# Altium project Dentist_camera_extender.PrjPcb
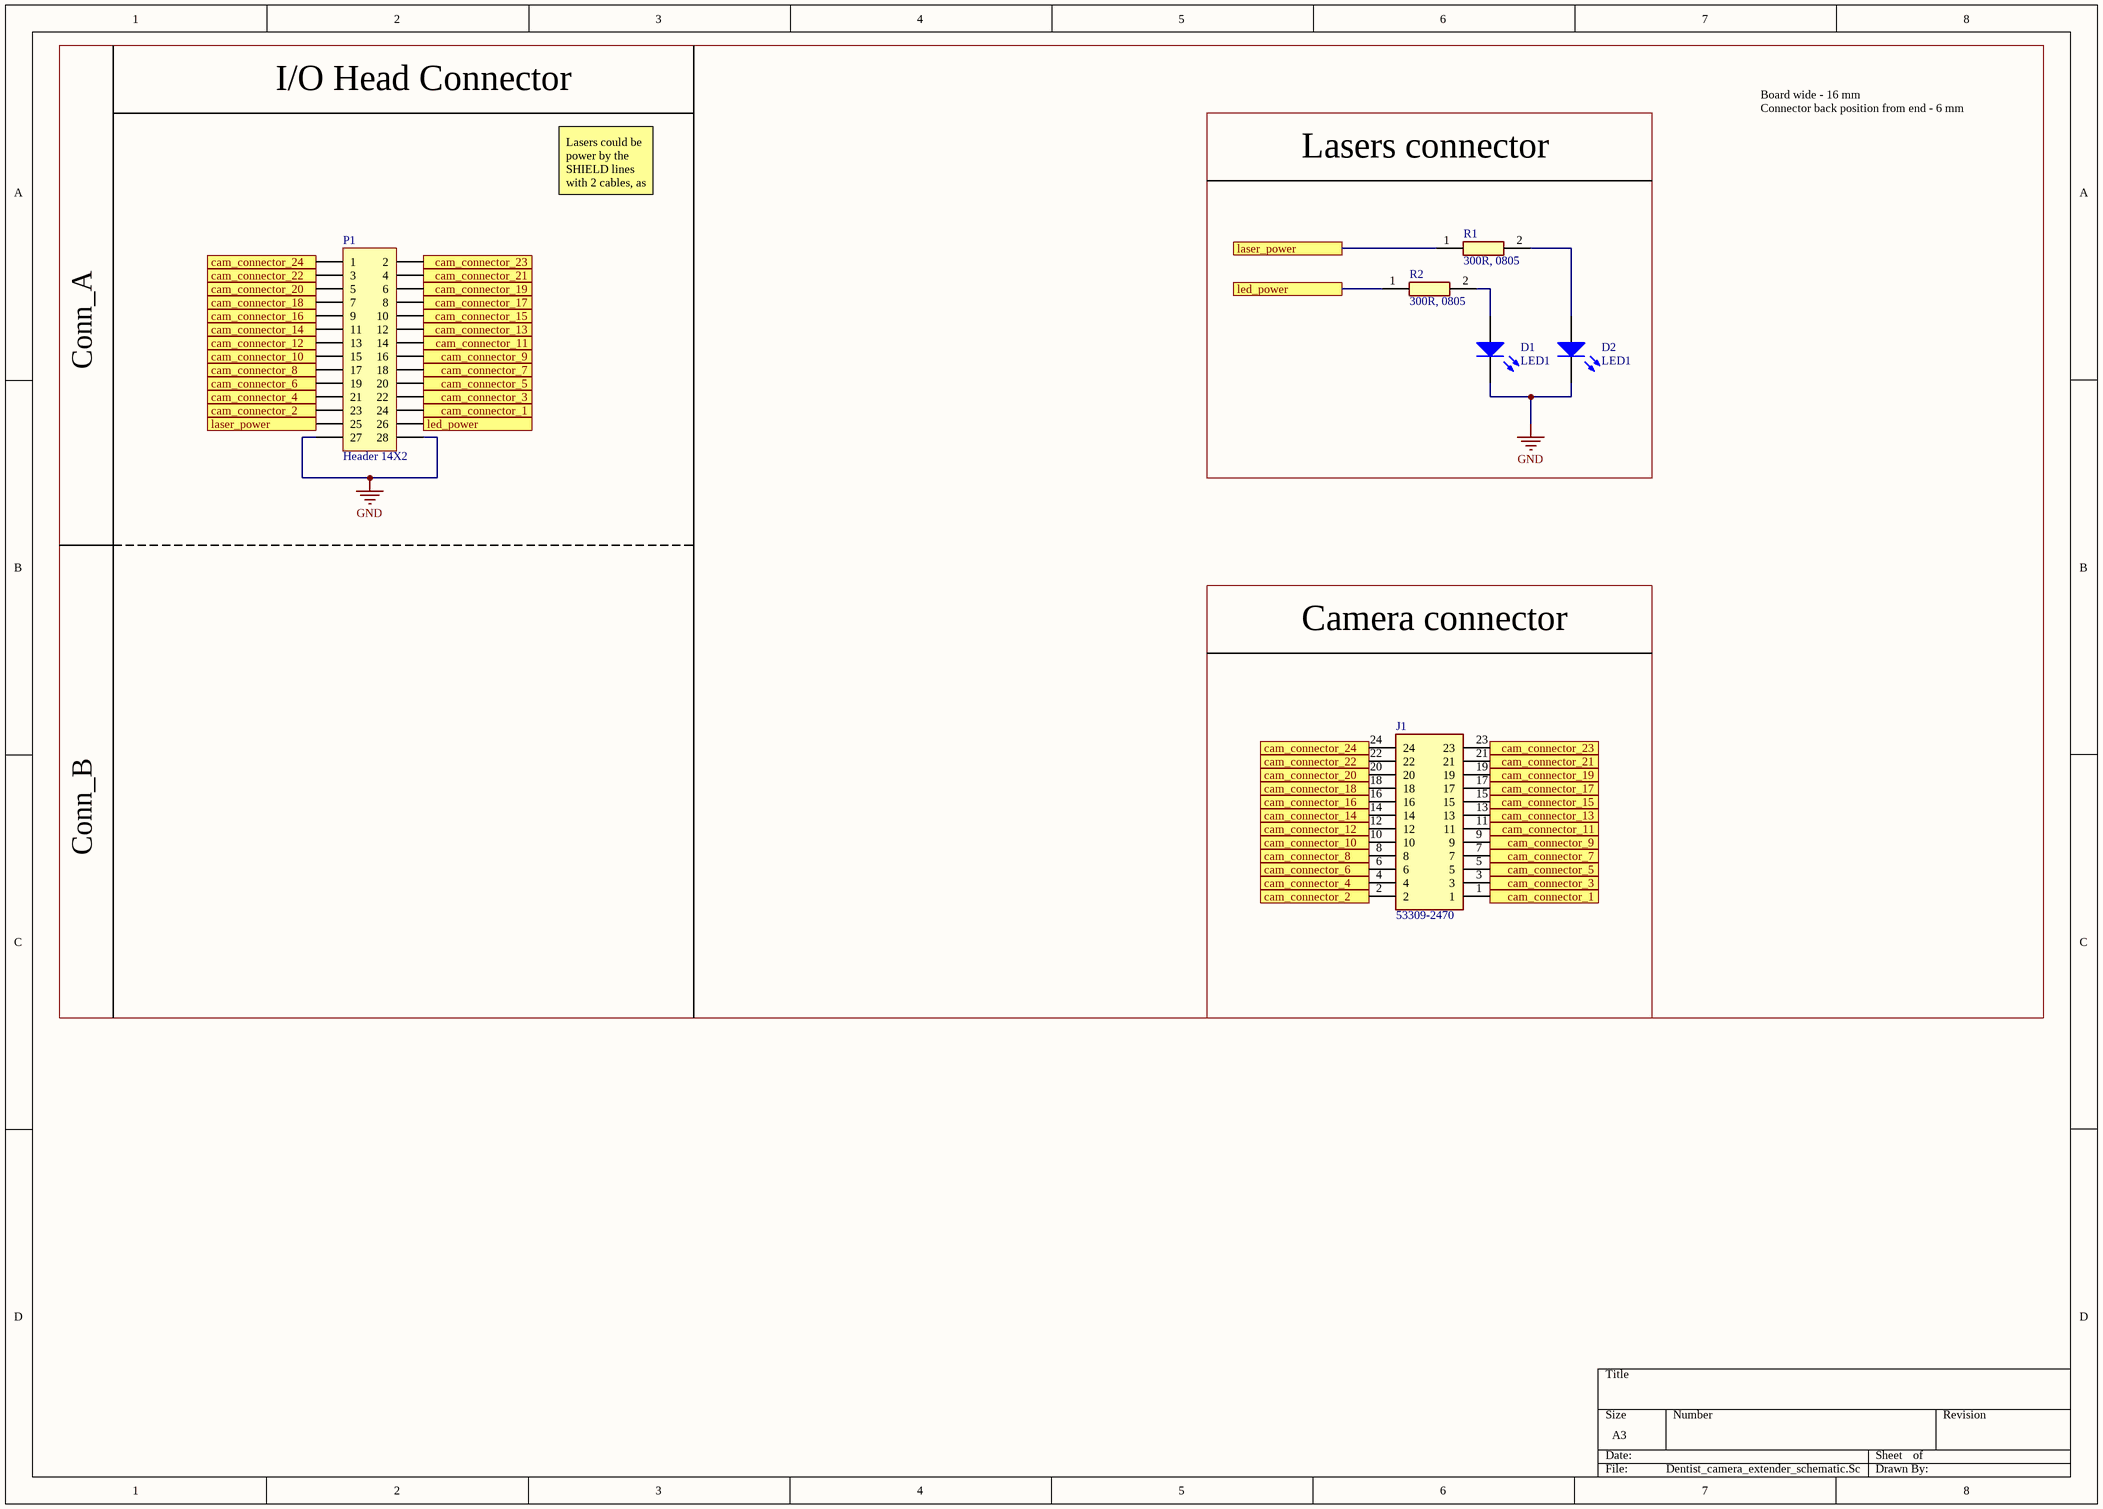
[diagram p0: Dentist_camera_extender_schematic.SchDoc]
4 sheets, 23 parts. Net scope: flat (ports and power ports of the same name join across sheets).
Board files: Dentist_camera_extender_board.PcbDoc, Dentist_camera_extender_board_pcb_2.PcbDoc, Dentist_camera_extender_board_pcb_3.PcbDoc, Dentist_camera_extender_board_pcb_4.PcbDoc, Dentist_camera_extender_board_pcb_stack.PcbDoc
Sheets:
  Dentist_camera_extender_schematic.SchDoc
  Dentist_camera_extender_schematic_sch_2.SchDoc
  Dentist_camera_extender_schematic_sch_3.SchDoc
  Dentist_camera_extender_schematic_sch_4.SchDoc

## Sheet Dentist_camera_extender_schematic.SchDoc
size A3; SheetNumber: 1; SheetTotal: 2

### Parts
D1  LED1  [2_PIN_CONNECTOR]
D2  LED1  [2_PIN_CONNECTOR]
J1  53309-2470  [533092470]
P1  Header 14X2  [HDR2X14]
R1  300R, 0805  [RESC2012X65N]
R2  300R, 0805  [RESC2012X65N]

### Blocks framed on the sheet
I/O Head Connector: P1
Lasers connector: D1 D2 R1 R2
Camera connector: J1

### Ports
cam_connector_1, cam_connector_2, cam_connector_3, cam_connector_4, cam_connector_5, cam_connector_6, cam_connector_7, cam_connector_8, cam_connector_9, cam_connector_10, cam_connector_11, cam_connector_12, cam_connector_13, cam_connector_14, cam_connector_15, cam_connector_16, cam_connector_17, cam_connector_18, cam_connector_19, cam_connector_20, cam_connector_21, cam_connector_22, cam_connector_23, cam_connector_24, laser_power, led_power

### Nets
GND: D1.2(K) D2.2(K) P1.27 P1.28
NetD1_1: D1.1(A) R2.2
NetD2_1: D2.1(A) R1.2
NetJ1_1: J1.1 P1.24 ; port cam_connector_1
NetJ1_2: J1.2 P1.23 ; port cam_connector_2
NetJ1_3: J1.3 P1.22 ; port cam_connector_3
NetJ1_4: J1.4 P1.21 ; port cam_connector_4
NetJ1_5: J1.5 P1.20 ; port cam_connector_5
NetJ1_6: J1.6 P1.19 ; port cam_connector_6
NetJ1_7: J1.7 P1.18 ; port cam_connector_7
NetJ1_8: J1.8 P1.17 ; port cam_connector_8
NetJ1_9: J1.9 P1.16 ; port cam_connector_9
NetJ1_10: J1.10 P1.15 ; port cam_connector_10
NetJ1_11: J1.11 P1.14 ; port cam_connector_11
NetJ1_12: J1.12 P1.13 ; port cam_connector_12
NetJ1_13: J1.13 P1.12 ; port cam_connector_13
NetJ1_14: J1.14 P1.11 ; port cam_connector_14
NetJ1_15: J1.15 P1.10 ; port cam_connector_15
NetJ1_16: J1.16 P1.9 ; port cam_connector_16
NetJ1_17: J1.17 P1.8 ; port cam_connector_17
NetJ1_18: J1.18 P1.7 ; port cam_connector_18
NetJ1_19: J1.19 P1.6 ; port cam_connector_19
NetJ1_20: J1.20 P1.5 ; port cam_connector_20
NetJ1_21: J1.21 P1.4 ; port cam_connector_21
NetJ1_22: J1.22 P1.3 ; port cam_connector_22
NetJ1_23: J1.23 P1.2 ; port cam_connector_23
NetJ1_24: J1.24 P1.1 ; port cam_connector_24
NetJ2_1_13: P1.26 R2.1 ; port led_power
NetJ2_1_28: P1.25 R1.1 ; port laser_power

### Notes on the sheet
- Board wide - 16 mm
  Connector back position from end - 6 mm
- Lasers could be power by the SHIELD lines with 2 cables, as L+ and GND
- Conn_A
- Conn_B

### Library data of the parts
D1 D2 = LED1: Typical RED GaAs LED; Published: 8-Jun-2000; LatestRevisionDate: 08-Jul-2005; LatestRevisionNote: Mech Layer 1 removed.; PackageReference: LED-1; Publisher: Altium Limited; PackageDescription: LED; 2 Leads
J1 = 53309-2470: Connector; Manufacturer_Name: Molex; Manufacturer_Part_Number: 53307-2471; Datasheet Link: https://www.mouser.com/datasheet/2/276/0533072471_PCB_HEADERS-146544.pdf; Height: 3.85mm; Mouser Part Number: 538-53307-2471; Mouser Price/Stock: https://www.mouser.co.uk/ProductDetail/Molex/53307-2471?qs=3DzawVMofg%252Bx9c%2FNm7UacA%3D%3D
P1 = Header 14X2: Header, 14-Pin, Dual row; LatestRevisionDate: 17-Jul-2002; LatestRevisionNote: Re-released for DXP Platform.; Publisher: Altium Limited
R1 R2 = CPF0805B100RE1: Resistor; Manufacturer_Name: TE Connectivity; Datasheet Link: http://docs-europe.electrocomponents.com/webdocs/13d1/0900766b813d116f.pdf; Height: 0.65mm; Manufacturer_Part_Number: CPF0805B100RE1; Mouser Part Number: 279-CPF0805B100RE1; Mouser Price/Stock: https://www.mouser.co.uk/ProductDetail/TE-Connectivity-Neohm/CPF0805B100RE1/?qs=9ylKvqdyudkCWLPT1QvLZQ%3D%3D; Arrow Part Number: CPF0805B100RE1; Arrow Price/Stock: https://www.arrow.com/en/products/cpf0805b100re1/te-connectivity

## Sheet Dentist_camera_extender_schematic_sch_2.SchDoc
size A3; SheetNumber: 2; SheetTotal: 4
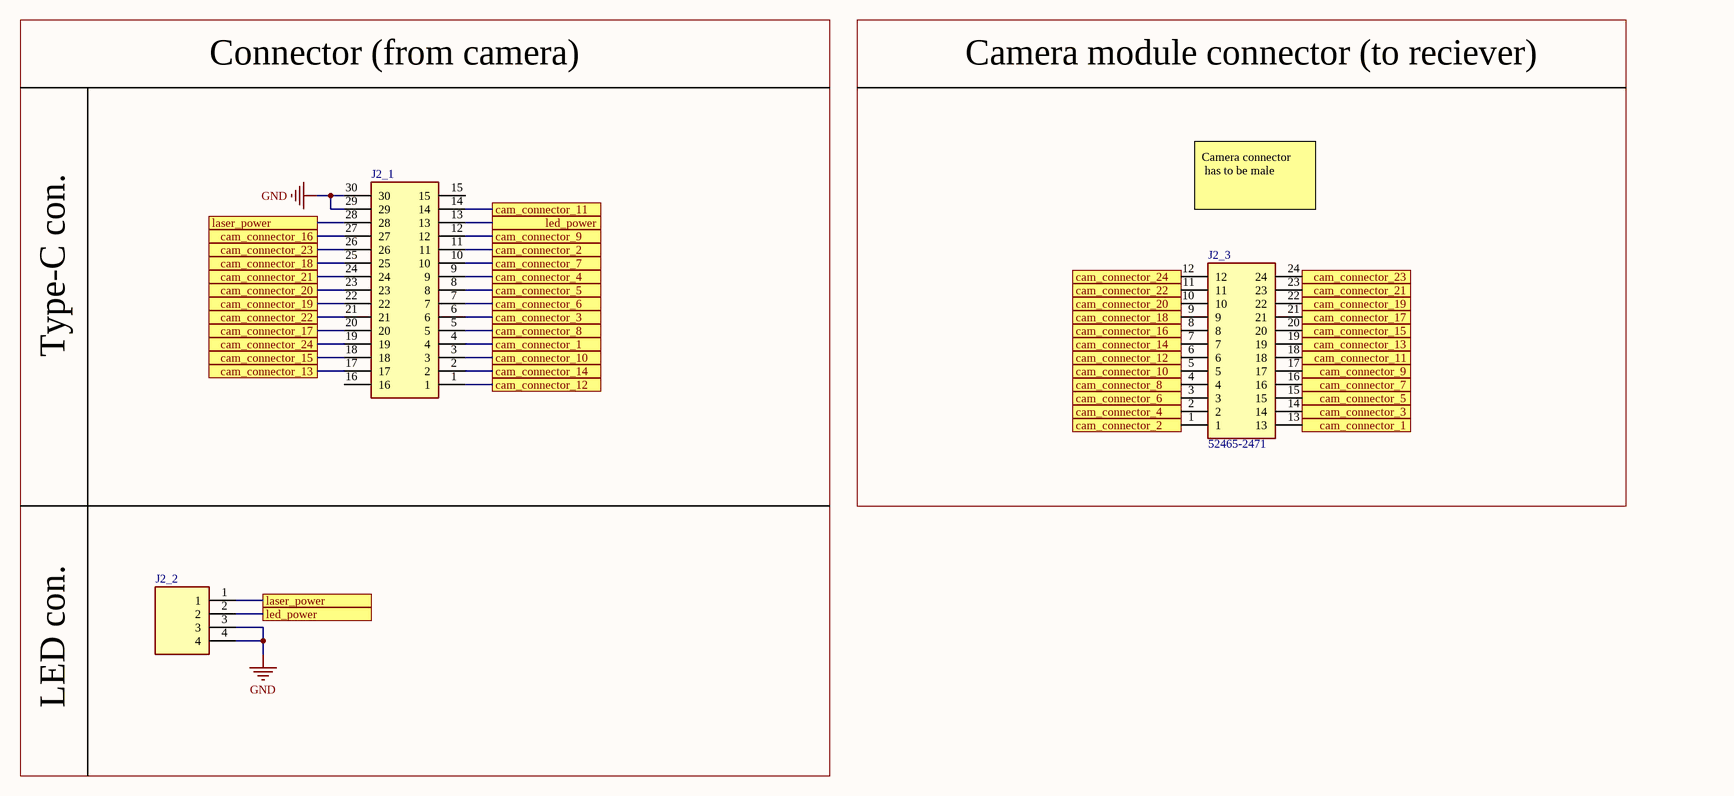
[diagram p1: Dentist_camera_extender_schematic_sch_2.SchDoc]

### Parts
J2_1  30 pin connector  [30_PIN_CONNECTOR]  (value not drawn)
J2_2  B04B-JWPF-SK-R_LF__SN_  [B04BJWPFSKRLFSN]  (value not drawn)
J2_3  52465-2471  [524652471]

### Blocks framed on the sheet
Camera module connector (to reciever): J2_3

### Ports
cam_connector_1, cam_connector_2, cam_connector_3, cam_connector_4, cam_connector_5, cam_connector_6, cam_connector_7, cam_connector_8, cam_connector_9, cam_connector_10, cam_connector_11, cam_connector_12, cam_connector_13, cam_connector_14, cam_connector_15, cam_connector_16, cam_connector_17, cam_connector_18, cam_connector_19, cam_connector_20, cam_connector_21, cam_connector_22, cam_connector_23, cam_connector_24, laser_power, led_power

### Nets
GND: J2_1.29 J2_1.30 J2_2.3 J2_2.4
NetJ1_1: J2_1.4 J2_3.13 ; port cam_connector_1
NetJ1_2: J2_1.11 J2_3.1 ; port cam_connector_2
NetJ1_3: J2_1.6 J2_3.14 ; port cam_connector_3
NetJ1_4: J2_1.9 J2_3.2 ; port cam_connector_4
NetJ1_5: J2_1.8 J2_3.15 ; port cam_connector_5
NetJ1_6: J2_1.7 J2_3.3 ; port cam_connector_6
NetJ1_7: J2_1.10 J2_3.16 ; port cam_connector_7
NetJ1_8: J2_1.5 J2_3.4 ; port cam_connector_8
NetJ1_9: J2_1.12 J2_3.17 ; port cam_connector_9
NetJ1_10: J2_1.3 J2_3.5 ; port cam_connector_10
NetJ1_11: J2_1.14 J2_3.18 ; port cam_connector_11
NetJ1_12: J2_1.1 J2_3.6 ; port cam_connector_12
NetJ1_13: J2_1.17 J2_3.19 ; port cam_connector_13
NetJ1_14: J2_1.2 J2_3.7 ; port cam_connector_14
NetJ1_15: J2_1.18 J2_3.20 ; port cam_connector_15
NetJ1_16: J2_1.27 J2_3.8 ; port cam_connector_16
NetJ1_17: J2_1.20 J2_3.21 ; port cam_connector_17
NetJ1_18: J2_1.25 J2_3.9 ; port cam_connector_18
NetJ1_19: J2_1.22 J2_3.22 ; port cam_connector_19
NetJ1_20: J2_1.23 J2_3.10 ; port cam_connector_20
NetJ1_21: J2_1.24 J2_3.23 ; port cam_connector_21
NetJ1_22: J2_1.21 J2_3.11 ; port cam_connector_22
NetJ1_23: J2_1.26 J2_3.24 ; port cam_connector_23
NetJ1_24: J2_1.19 J2_3.12 ; port cam_connector_24
NetJ2_1_13: J2_1.13 J2_2.2 ; port led_power
NetJ2_1_28: J2_1.28 J2_2.1 ; port laser_power

Not connected (* = marked no-connect by the designer): J2_1 15 16

### Notes on the sheet
- Connector (from camera)
- Camera connector
  has to be male
- Type-C con.
- LED con.

### Library data of the parts
J2_2 = B04B-JWPF-SK-R_LF__SN_: Connector; Manufacturer_Name: JST (JAPAN SOLDERLESS TERMINALS); Manufacturer_Part_Number: B04B-JWPF-SK-R(LF)(SN); Datasheet Link: https://componentsearchengine.com/Datasheets/2/B04B-JWPF-SK-R(LF)(SN).pdf; Height: 16.6mm
J2_3 = 52465-2471: Connector; Manufacturer_Name: Molex; Datasheet Link: https://www.molex.com/pdm_docs/sd/524652471_sd.pdf; Height: 3.75mm; Manufacturer_Part_Number: 52465-2471; Mouser Part Number: 538-52465-2471; Mouser Price/Stock: https://www.mouser.co.uk/ProductDetail/Molex/52465-2471?qs=oPDuosDifXEuWhdL4yjOXg%3D%3D

## Sheet Dentist_camera_extender_schematic_sch_3.SchDoc
size A3; SheetNumber: 3; SheetTotal: 3
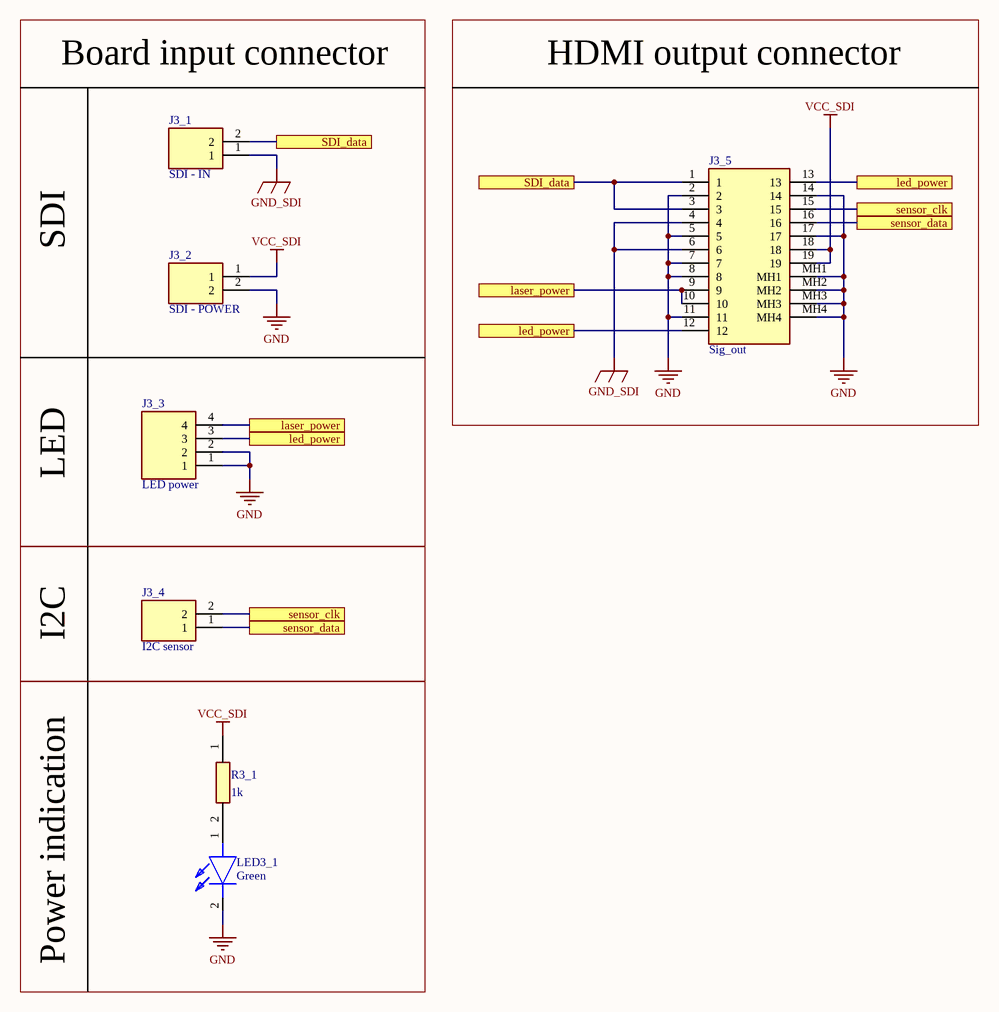
[diagram p2: Dentist_camera_extender_schematic_sch_3.SchDoc]

### Parts
J3_1  SDI - IN  [B02BJWPFSKRLFSN]
J3_2  SDI - POWER  [B02BJWPFSKRLFSN]
J3_3  LED power  [B04BJWPFSKRLFSN]
J3_4  I2C sensor  [B02BJWPFSKRLFSN]
J3_5  Sig_out  [10029449001RLF]
LED3_1  Green  [1721SYGCS530E2TR8]
R3_1  1k  [ERA6AEB1020V]

### Blocks framed on the sheet
HDMI output connector: J3_5
I2C: J3_4
Power indication: LED3_1 R3_1

### Ports
laser_power, led_power, SDI_data, sensor_clk, sensor_data

### Nets
GND: J3_2.2 J3_3.1 J3_3.2 J3_5.2 J3_5.5 J3_5.7 J3_5.8 J3_5.11 J3_5.14 J3_5.17 J3_5.MH1 J3_5.MH2 J3_5.MH3 J3_5.MH4 LED3_1.2(K)
GND_SDI: J3_1.1 J3_5.4 J3_5.6
VCC_SDI: J3_2.1 J3_5.18 J3_5.19 R3_1.1
NetJ2_1_13: J3_3.3 J3_5.12 J3_5.13 ; port led_power
NetJ2_1_28: J3_3.4 J3_5.9 J3_5.10 ; port laser_power
NetJ3_1_2: J3_1.2 J3_5.1 J3_5.3 ; port SDI_data
NetJ3_4_1: J3_4.1 J3_5.16 ; port sensor_data
NetJ3_4_2: J3_4.2 J3_5.15 ; port sensor_clk
NetLED3_1_1: LED3_1.1(A) R3_1.2

### Notes on the sheet
- Board input connector
- SDI
- LED

### Library data of the parts
J3_1 J3_2 J3_4 = B02B-JWPF-SK-R_LF__SN_: Connector; Manufacturer_Name: JST (JAPAN SOLDERLESS TERMINALS); Manufacturer_Part_Number: B02B-JWPF-SK-R(LF)(SN); Datasheet Link: https://datasheet.datasheetarchive.com/originals/dk/DKDS-13/257039.pdf; Height: 16.6mm; Arrow Part Number: B02B-JWPF-SK-R(LF)(SN); Arrow Price/Stock: https://www.arrow.com/en/products/b02b-jwpf-sk-r-lf-sn/jst-manufacturing
J3_3 = B04B-JWPF-SK-R_LF__SN_: as J2_2 on sheet Dentist_camera_extender_schematic_sch_2; Datasheet Link: https://componentsearchengine.com/Datasheets/2/B04B-JWPF-SK-R(LF)(SN).pdf; Height: 16.6mm
J3_5 = 10029449-001RLF: Manufacturer_Name: Amphenol; Datasheet Link: https://cdn.amphenol-icc.com/media/wysiwyg/files/drawing/10029449.pdf; Height: 6.3mm; Manufacturer_Part_Number: 10029449-001RLF; Mouser Part Number: 649-10029449-001RLF; Mouser Price/Stock: https://www.mouser.co.uk/ProductDetail/Amphenol-FCI/10029449-001RLF?qs=D%252By4jQJzx8L60NhBOOKSqQ%3D%3D; Arrow Part Number: 10029449-001RLF; Arrow Price/Stock: https://www.arrow.com/en/products/10029449-001rlf/amphenol-fci?region=nac
LED3_1 = 17-21SYGC_S530-E2_TR8: LED; Manufacturer_Name: Everlight; Manufacturer_Part_Number: 17-21SYGC/S530-E2/TR8; Datasheet Link: https://media.digikey.com/pdf/Data%20Sheets/Everlight%20PDFs/17-21SYGC,S530-E2,TR8.pdf; Height: 1.1mm; Mouser Part Number: 638-1721SYGCS530E2; Mouser Price/Stock: https://www.mouser.co.uk/ProductDetail/Everlight/17-21SYGC-S530-E2-TR8?qs=8PzhAHr7IdMM%252BF4DSbsAKQ%3D%3D; Arrow Part Number: 17-21SYGC/S530-E2/TR8; Arrow Price/Stock: https://www.arrow.com/en/products/17-21sygcs530-e2tr8/everlight-electronics?region=nac
R3_1 = ERA6ARB103V: Manufacturer_Name: Panasonic; Datasheet Link: https://industrial.panasonic.com/cdbs/www-data/pdf/RDM0000/AOA0000C307.pdf; Height: 0.6mm; Manufacturer_Part_Number: ERA6ARB103V; Arrow Part Number: ERA6ARB103V; Arrow Price/Stock: https://www.arrow.com/en/products/era-6arb103v/panasonic

## Sheet Dentist_camera_extender_schematic_sch_4.SchDoc
size A3; SheetNumber: 4; SheetTotal: 4
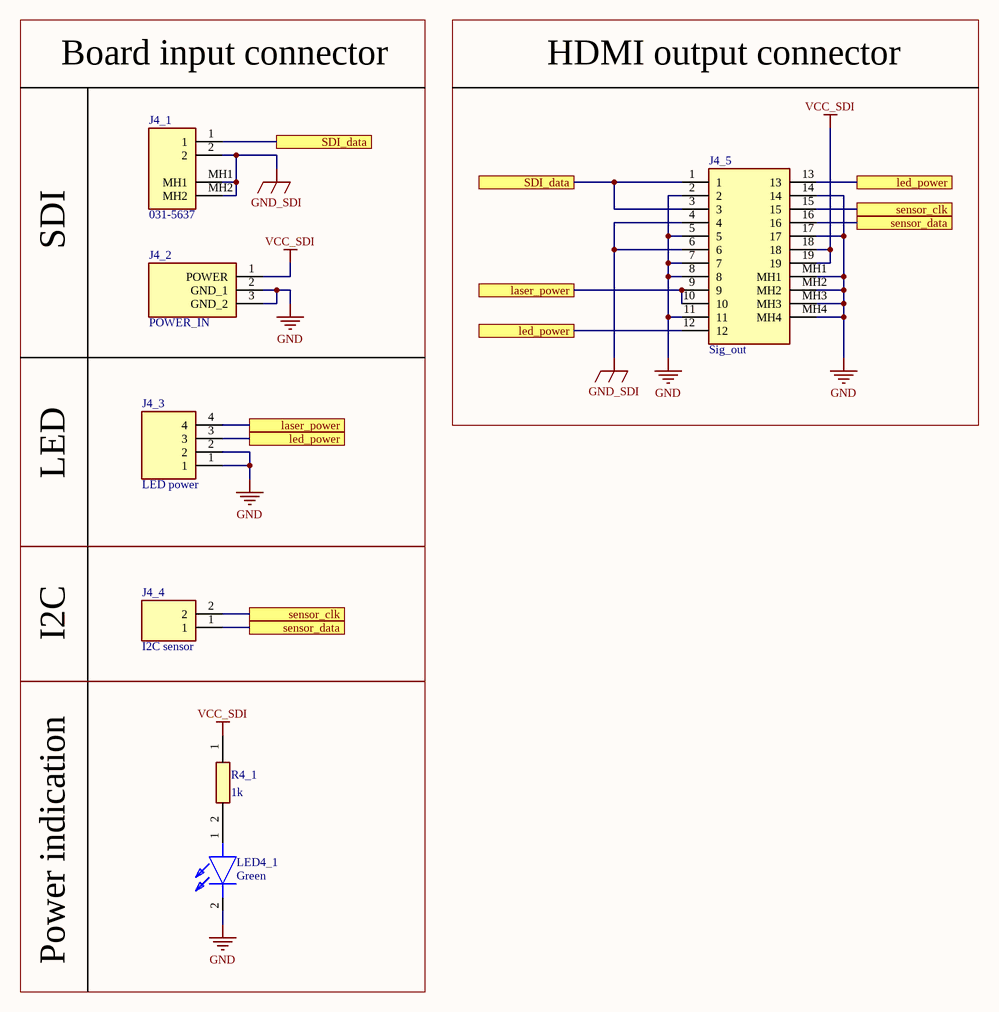
[diagram p3: Dentist_camera_extender_schematic_sch_4.SchDoc]

### Parts
J4_1  031-5637  [0315637]
J4_2  POWER_IN  [694106301002_1]
J4_3  LED power  [B04BJWPFSKRLFSN]
J4_4  I2C sensor  [B02BJWPFSKRLFSN]
J4_5  Sig_out  [10029449001RLF]
LED4_1  Green  [1721SYGCS530E2TR8]
R4_1  1k  [ERA6AEB1020V]

### Blocks framed on the sheet
HDMI output connector: J4_5
I2C: J4_4
Power indication: LED4_1 R4_1

### Ports
laser_power, led_power, SDI_data, sensor_clk, sensor_data

### Nets
GND: J4_2.2(GND_1) J4_2.3(GND_2) J4_3.1 J4_3.2 J4_5.2 J4_5.5 J4_5.7 J4_5.8 J4_5.11 J4_5.14 J4_5.17 J4_5.MH1 J4_5.MH2 J4_5.MH3 J4_5.MH4 LED4_1.2(K)
GND_SDI: J4_1.2 J4_1.MH1 J4_1.MH2 J4_5.4 J4_5.6
VCC_SDI: J4_2.1(POWER) J4_5.18 J4_5.19 R4_1.1
NetJ2_1_13: J4_3.3 J4_5.12 J4_5.13 ; port led_power
NetJ2_1_28: J4_3.4 J4_5.9 J4_5.10 ; port laser_power
NetJ3_1_2: J4_1.1 J4_5.1 J4_5.3 ; port SDI_data
NetJ3_4_1: J4_4.1 J4_5.16 ; port sensor_data
NetJ3_4_2: J4_4.2 J4_5.15 ; port sensor_clk
NetLED4_1_1: LED4_1.1(A) R4_1.2

### Notes on the sheet
- Board input connector
- SDI
- LED

### Library data of the parts
J4_1 = 031-5637: Connector; Manufacturer_Name: Amphenol; Datasheet Link: https://datasheet.datasheetarchive.com/originals/distributors/Datasheets-DGA15/760804.pdf; Manufacturer_Part_Number: 031-5637; Mouser Part Number: 523-31-5637; Mouser Price/Stock: https://www.mouser.co.uk/ProductDetail/Amphenol-RF/031-5637/?qs=%2FrA2Kvb8OYb4YSYQEIM5Nw%3D%3D; Arrow Part Number: 031-5637; Arrow Price/Stock: https://www.arrow.com/en/products/031-5637/amphenol-rf
J4_2 = 694106301002: Manufacturer_Name: Wurth Elektronik; Datasheet Link: https://datasheet.datasheetarchive.com/originals/distributors/Datasheets_SAMA/1c153bd2ba42bb51bda59ee4cd9765cd.pdf; Manufacturer_Part_Number: 694106301002; Mouser Part Number: 710-694106301002; Mouser Price/Stock: https://www.mouser.co.uk/ProductDetail/Wurth-Elektronik/694106301002?qs=a9WhcLg8qCwOEkcI62k5mA%3D%3D
J4_3 = B04B-JWPF-SK-R_LF__SN_: as J2_2 on sheet Dentist_camera_extender_schematic_sch_2; Datasheet Link: https://componentsearchengine.com/Datasheets/2/B04B-JWPF-SK-R(LF)(SN).pdf; Height: 16.6mm
J4_4 = B02B-JWPF-SK-R_LF__SN_: as J3_1 on sheet Dentist_camera_extender_schematic_sch_3; Datasheet Link: https://datasheet.datasheetarchive.com/originals/dk/DKDS-13/257039.pdf; Height: 16.6mm; Arrow Part Number: B02B-JWPF-SK-R(LF)(SN); Arrow Price/Stock: https://www.arrow.com/en/products/b02b-jwpf-sk-r-lf-sn/jst-manufacturing
J4_5 = 10029449-001RLF: Manufacturer_Name: Amphenol; Datasheet Link: https://cdn.amphenol-icc.com/media/wysiwyg/files/drawing/10029449.pdf; Height: 6.3mm; Manufacturer_Part_Number: 10029449-001RLF; Mouser Part Number: 649-10029449-001RLF; Mouser Price/Stock: https://www.mouser.co.uk/ProductDetail/Amphenol-FCI/10029449-001RLF?qs=D%252By4jQJzx8L60NhBOOKSqQ%3D%3D; Arrow Part Number: 10029449-001RLF; Arrow Price/Stock: https://www.arrow.com/en/products/10029449-001rlf/amphenol-fci?region=nac
LED4_1 = 17-21SYGC_S530-E2_TR8: as LED3_1 on sheet Dentist_camera_extender_schematic_sch_3; Datasheet Link: https://media.digikey.com/pdf/Data%20Sheets/Everlight%20PDFs/17-21SYGC,S530-E2,TR8.pdf; Height: 1.1mm; Mouser Part Number: 638-1721SYGCS530E2; Mouser Price/Stock: https://www.mouser.co.uk/ProductDetail/Everlight/17-21SYGC-S530-E2-TR8?qs=8PzhAHr7IdMM%252BF4DSbsAKQ%3D%3D; Arrow Part Number: 17-21SYGC/S530-E2/TR8; Arrow Price/Stock: https://www.arrow.com/en/products/17-21sygcs530-e2tr8/everlight-electronics?region=nac
R4_1 = ERA6ARB103V: Manufacturer_Name: Panasonic; Datasheet Link: https://industrial.panasonic.com/cdbs/www-data/pdf/RDM0000/AOA0000C307.pdf; Height: 0.6mm; Manufacturer_Part_Number: ERA6ARB103V; Arrow Part Number: ERA6ARB103V; Arrow Price/Stock: https://www.arrow.com/en/products/era-6arb103v/panasonic

## Nets that join several sheets
GND: Dentist_camera_extender_schematic (D1.2 D2.2 P1.27 P1.28), Dentist_camera_extender_schematic_sch_2 (J2_1.29 J2_1.30 J2_2.3 J2_2.4), Dentist_camera_extender_schematic_sch_3 (15 pins), Dentist_camera_extender_schematic_sch_4 (16 pins)
GND_SDI: Dentist_camera_extender_schematic_sch_3 (J3_1.1 J3_5.4 J3_5.6), Dentist_camera_extender_schematic_sch_4 (5 pins)
VCC_SDI: Dentist_camera_extender_schematic_sch_3 (J3_2.1 J3_5.18 J3_5.19 R3_1.1), Dentist_camera_extender_schematic_sch_4 (J4_2.1 J4_5.18 J4_5.19 R4_1.1)
NetJ1_1: Dentist_camera_extender_schematic (J1.1 P1.24), Dentist_camera_extender_schematic_sch_2 (J2_1.4 J2_3.13)
NetJ1_2: Dentist_camera_extender_schematic (J1.2 P1.23), Dentist_camera_extender_schematic_sch_2 (J2_1.11 J2_3.1)
NetJ1_3: Dentist_camera_extender_schematic (J1.3 P1.22), Dentist_camera_extender_schematic_sch_2 (J2_1.6 J2_3.14)
NetJ1_4: Dentist_camera_extender_schematic (J1.4 P1.21), Dentist_camera_extender_schematic_sch_2 (J2_1.9 J2_3.2)
NetJ1_5: Dentist_camera_extender_schematic (J1.5 P1.20), Dentist_camera_extender_schematic_sch_2 (J2_1.8 J2_3.15)
NetJ1_6: Dentist_camera_extender_schematic (J1.6 P1.19), Dentist_camera_extender_schematic_sch_2 (J2_1.7 J2_3.3)
NetJ1_7: Dentist_camera_extender_schematic (J1.7 P1.18), Dentist_camera_extender_schematic_sch_2 (J2_1.10 J2_3.16)
NetJ1_8: Dentist_camera_extender_schematic (J1.8 P1.17), Dentist_camera_extender_schematic_sch_2 (J2_1.5 J2_3.4)
NetJ1_9: Dentist_camera_extender_schematic (J1.9 P1.16), Dentist_camera_extender_schematic_sch_2 (J2_1.12 J2_3.17)
NetJ1_10: Dentist_camera_extender_schematic (J1.10 P1.15), Dentist_camera_extender_schematic_sch_2 (J2_1.3 J2_3.5)
NetJ1_11: Dentist_camera_extender_schematic (J1.11 P1.14), Dentist_camera_extender_schematic_sch_2 (J2_1.14 J2_3.18)
NetJ1_12: Dentist_camera_extender_schematic (J1.12 P1.13), Dentist_camera_extender_schematic_sch_2 (J2_1.1 J2_3.6)
NetJ1_13: Dentist_camera_extender_schematic (J1.13 P1.12), Dentist_camera_extender_schematic_sch_2 (J2_1.17 J2_3.19)
NetJ1_14: Dentist_camera_extender_schematic (J1.14 P1.11), Dentist_camera_extender_schematic_sch_2 (J2_1.2 J2_3.7)
NetJ1_15: Dentist_camera_extender_schematic (J1.15 P1.10), Dentist_camera_extender_schematic_sch_2 (J2_1.18 J2_3.20)
NetJ1_16: Dentist_camera_extender_schematic (J1.16 P1.9), Dentist_camera_extender_schematic_sch_2 (J2_1.27 J2_3.8)
NetJ1_17: Dentist_camera_extender_schematic (J1.17 P1.8), Dentist_camera_extender_schematic_sch_2 (J2_1.20 J2_3.21)
NetJ1_18: Dentist_camera_extender_schematic (J1.18 P1.7), Dentist_camera_extender_schematic_sch_2 (J2_1.25 J2_3.9)
NetJ1_19: Dentist_camera_extender_schematic (J1.19 P1.6), Dentist_camera_extender_schematic_sch_2 (J2_1.22 J2_3.22)
NetJ1_20: Dentist_camera_extender_schematic (J1.20 P1.5), Dentist_camera_extender_schematic_sch_2 (J2_1.23 J2_3.10)
NetJ1_21: Dentist_camera_extender_schematic (J1.21 P1.4), Dentist_camera_extender_schematic_sch_2 (J2_1.24 J2_3.23)
NetJ1_22: Dentist_camera_extender_schematic (J1.22 P1.3), Dentist_camera_extender_schematic_sch_2 (J2_1.21 J2_3.11)
NetJ1_23: Dentist_camera_extender_schematic (J1.23 P1.2), Dentist_camera_extender_schematic_sch_2 (J2_1.26 J2_3.24)
NetJ1_24: Dentist_camera_extender_schematic (J1.24 P1.1), Dentist_camera_extender_schematic_sch_2 (J2_1.19 J2_3.12)
NetJ2_1_13: Dentist_camera_extender_schematic (P1.26 R2.1), Dentist_camera_extender_schematic_sch_2 (J2_1.13 J2_2.2), Dentist_camera_extender_schematic_sch_3 (J3_3.3 J3_5.12 J3_5.13), Dentist_camera_extender_schematic_sch_4 (J4_3.3 J4_5.12 J4_5.13)
NetJ2_1_28: Dentist_camera_extender_schematic (P1.25 R1.1), Dentist_camera_extender_schematic_sch_2 (J2_1.28 J2_2.1), Dentist_camera_extender_schematic_sch_3 (J3_3.4 J3_5.9 J3_5.10), Dentist_camera_extender_schematic_sch_4 (J4_3.4 J4_5.9 J4_5.10)
NetJ3_1_2: Dentist_camera_extender_schematic_sch_3 (J3_1.2 J3_5.1 J3_5.3), Dentist_camera_extender_schematic_sch_4 (J4_1.1 J4_5.1 J4_5.3)
NetJ3_4_1: Dentist_camera_extender_schematic_sch_3 (J3_4.1 J3_5.16), Dentist_camera_extender_schematic_sch_4 (J4_4.1 J4_5.16)
NetJ3_4_2: Dentist_camera_extender_schematic_sch_3 (J3_4.2 J3_5.15), Dentist_camera_extender_schematic_sch_4 (J4_4.2 J4_5.15)